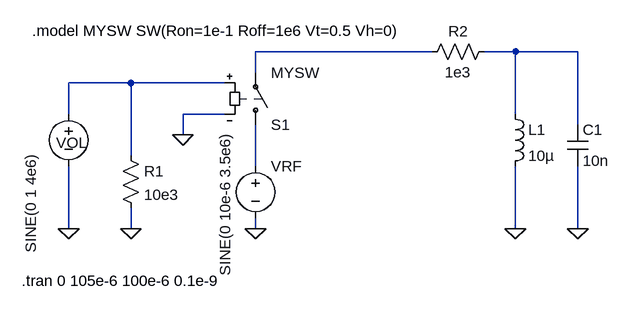
[diagram p0: schematic lineal_no_invar.asc]
lineal_no_invar.asc, the LTspice schematic file:
Version 4
SHEET 1 928 680
WIRE 576 0 304 0
WIRE 704 0 656 0
WIRE 800 0 704 0
WIRE 304 32 304 0
WIRE 112 48 16 48
WIRE 256 48 112 48
WIRE 16 96 16 48
WIRE 256 96 192 96
WIRE 704 96 704 0
WIRE 800 112 800 0
WIRE 192 128 192 96
WIRE 112 160 112 48
WIRE 304 176 304 112
WIRE 16 272 16 176
WIRE 112 272 112 240
WIRE 304 272 304 256
WIRE 704 272 704 176
WIRE 800 272 800 176
FLAG 16 272 0
FLAG 304 272 0
FLAG 192 128 0
FLAG 704 272 0
FLAG 800 272 0
FLAG 112 272 0
SYMBOL sw 304 128 M180
SYMATTR InstName S1
SYMATTR Value MYSW
SYMBOL voltage 16 80 R0
WINDOW 0 -19 60 Left 2
WINDOW 3 -58 230 VLeft 2
WINDOW 123 0 0 Left 0
WINDOW 39 0 0 Left 0
SYMATTR InstName VOL
SYMATTR Value SINE(0 1 4e6)
SYMBOL voltage 304 160 R0
WINDOW 3 -47 185 VLeft 2
WINDOW 123 0 0 Left 0
WINDOW 39 0 0 Left 0
SYMATTR Value SINE(0 10e-6 3.5e6)
SYMATTR InstName VRF
SYMBOL res 672 -16 R90
WINDOW 0 0 56 VBottom 2
WINDOW 3 32 56 VTop 2
SYMATTR InstName R2
SYMATTR Value 1e3
SYMBOL ind 688 80 R0
SYMATTR InstName L1
SYMATTR Value 10µ
SYMBOL cap 784 112 R0
SYMATTR InstName C1
SYMATTR Value 10n
SYMBOL res 96 144 R0
SYMATTR InstName R1
SYMATTR Value 10e3
TEXT -40 -32 Left 2 !.model MYSW SW(Ron=1e-1 Roff=1e6 Vt=0.5 Vh=0)
TEXT -56 352 Left 2 !.tran 0 105e-6 100e-6 0.1e-9

The netlist it stands for:
* lineal_no_invar.asc
S1 N004 N001 N003 0 MYSW
VOL N003 0 SINE(0 1 4e6)
VRF N004 0 SINE(0 10e-6 3.5e6)
R2 N002 N001 1e3
L1 N002 0 10µ
C1 N002 0 10n
R1 N003 0 10e3
.model MYSW SW(Ron=1e-1 Roff=1e6 Vt=0.5 Vh=0)
.tran 0 105e-6 100e-6 0.1e-9
.backanno
.end